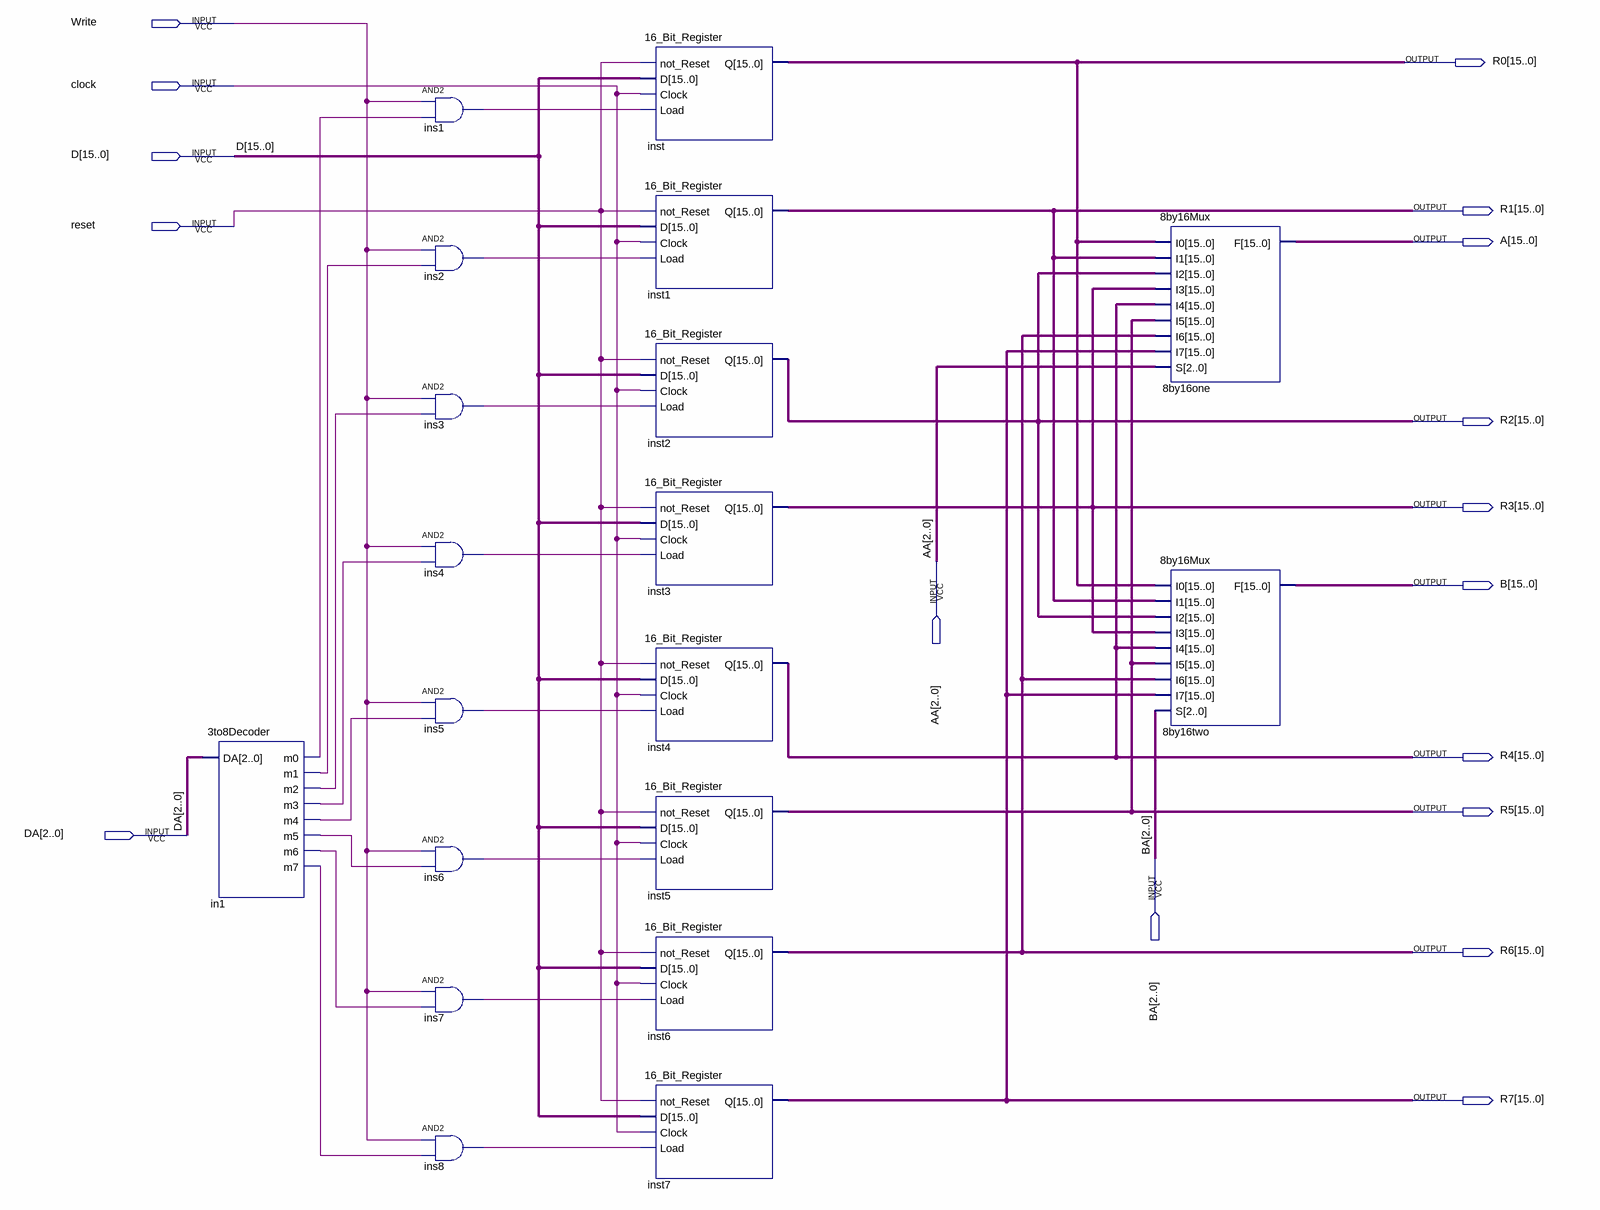
[diagram p0: schematic sheet]
// Quartus schematic 8by16RegFile.bdf as structural Verilog: 19 symbols, 17 pins
module \8by16RegFile  (
  input  Write,
  input  clock,
  input  [15:0] D,
  input  reset,
  input  [2:0] AA,
  input  [2:0] DA,
  input  [2:0] BA,
  output [15:0] R0,
  output [15:0] R1,
  output [15:0] A,
  output [15:0] R2,
  output [15:0] R3,
  output [15:0] B,
  output [15:0] R4,
  output [15:0] R5,
  output [15:0] R6,
  output [15:0] R7
);

  wire in1_m0, in1_m1, in1_m2, in1_m3, in1_m4, in1_m5, in1_m6, in1_m7, ins1_out, ins2_out, ins3_out,
       ins4_out, ins5_out, ins6_out, ins7_out, ins8_out;

  \3to8Decoder  in1 (
    .DA(DA), .m0(in1_m0), .m1(in1_m1), .m2(in1_m2), .m3(in1_m3), .m4(in1_m4), .m5(in1_m5), .m6(in1_m6),
    .m7(in1_m7));
  and ins1 (ins1_out, Write, in1_m0);
  and ins2 (ins2_out, Write, in1_m1);
  and ins3 (ins3_out, Write, in1_m2);
  and ins4 (ins4_out, Write, in1_m3);
  and ins5 (ins5_out, Write, in1_m4);
  and ins6 (ins6_out, Write, in1_m5);
  and ins7 (ins7_out, Write, in1_m6);
  and ins8 (ins8_out, Write, in1_m7);
  \16_Bit_Register  inst (.not_Reset(reset), .D(D), .Clock(clock), .Load(ins1_out), .Q(R0));
  \16_Bit_Register  inst1 (.not_Reset(reset), .D(D), .Clock(clock), .Load(ins2_out), .Q(R1));
  \16_Bit_Register  inst2 (.not_Reset(reset), .D(D), .Clock(clock), .Load(ins3_out), .Q(R2));
  \16_Bit_Register  inst3 (.not_Reset(reset), .D(D), .Clock(clock), .Load(ins4_out), .Q(R3));
  \16_Bit_Register  inst4 (.not_Reset(reset), .D(D), .Clock(clock), .Load(ins5_out), .Q(R4));
  \16_Bit_Register  inst5 (.not_Reset(reset), .D(D), .Clock(clock), .Load(ins6_out), .Q(R5));
  \16_Bit_Register  inst6 (.not_Reset(reset), .D(D), .Clock(clock), .Load(ins7_out), .Q(R6));
  \16_Bit_Register  inst7 (.not_Reset(reset), .D(D), .Clock(clock), .Load(ins8_out), .Q(R7));
  \8by16Mux  u_8by16one (.S(AA), .I0(R0), .I1(R1), .I2(R2), .I3(R3), .I4(R4), .I5(R5), .I6(R6), .I7(R7), .F(A));
  \8by16Mux  u_8by16two (.S(BA), .I0(R0), .I1(R1), .I2(R2), .I3(R3), .I4(R4), .I5(R5), .I6(R6), .I7(R7), .F(B));
endmodule
